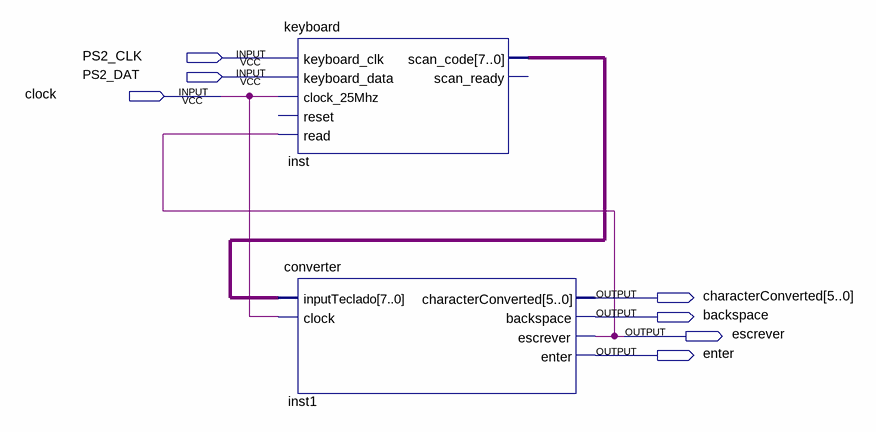
[diagram p0: schematic sheet]
// Quartus schematic keyboardSimplifier.bdf as structural Verilog: 2 symbols, 7 pins
module keyboardSimplifier (
  input  PS2_CLK,
  input  PS2_DAT,
  input  clock,
  output [5:0] characterConverted,
  output backspace,
  output escrever,
  output enter
);

  wire [7:0] inst_scan_code;

  keyboard inst (
    .keyboard_clk(PS2_CLK), .keyboard_data(PS2_DAT), .clock_25Mhz(clock), .read(escrever),
    .scan_code(inst_scan_code));  // open: reset, scan_ready
  converter inst1 (
    .inputTeclado(inst_scan_code), .clock(clock), .characterConverted(characterConverted),
    .backspace(backspace), .escrever(escrever), .enter(enter));
endmodule
